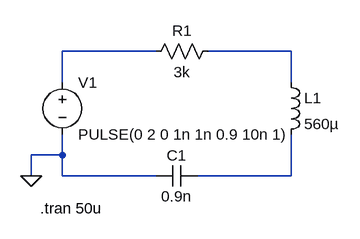
[diagram p0: schematic rlc.asc]
rlc.asc, the LTspice schematic file:
Version 4
SHEET 1 880 680
WIRE 240 32 96 32
WIRE 448 32 320 32
WIRE 96 80 96 32
WIRE 448 80 448 32
WIRE 96 192 96 160
WIRE 96 192 48 192
WIRE 48 224 48 192
WIRE 96 224 96 192
WIRE 240 224 96 224
WIRE 448 224 448 160
WIRE 448 224 304 224
FLAG 48 224 0
SYMBOL voltage 96 64 R0
WINDOW 123 0 0 Left 0
WINDOW 39 0 0 Left 0
SYMATTR InstName V1
SYMATTR Value PULSE(0 2 0 1n 1n 0.9 10n 1)
SYMBOL res 336 16 R90
WINDOW 0 0 56 VBottom 2
WINDOW 3 32 56 VTop 2
SYMATTR InstName R1
SYMATTR Value 3k
SYMBOL ind 432 64 R0
SYMATTR InstName L1
SYMATTR Value 560µ
SYMBOL cap 304 208 R90
WINDOW 0 0 32 VBottom 2
WINDOW 3 32 32 VTop 2
SYMATTR InstName C1
SYMATTR Value 0.9n
TEXT 62 274 Left 2 !.tran 50u

The netlist it stands for:
* rlc.asc
V1 N001 0 PULSE(0 2 0 1n 1n 0.9 10n 1)
R1 N002 N001 3k
L1 N002 N003 560µ
C1 N003 0 0.9n
.tran 50u
.backanno
.end